# Altium schematic sheet BQ76952_AFE.SchDoc
size A4; Organization: TESLA Motors, INC; Address1: 3500 Deer Creek Road; Address2: Palo Alto, CA; Address4: U.S.A.; SheetNumber: 3; SheetTotal: 8
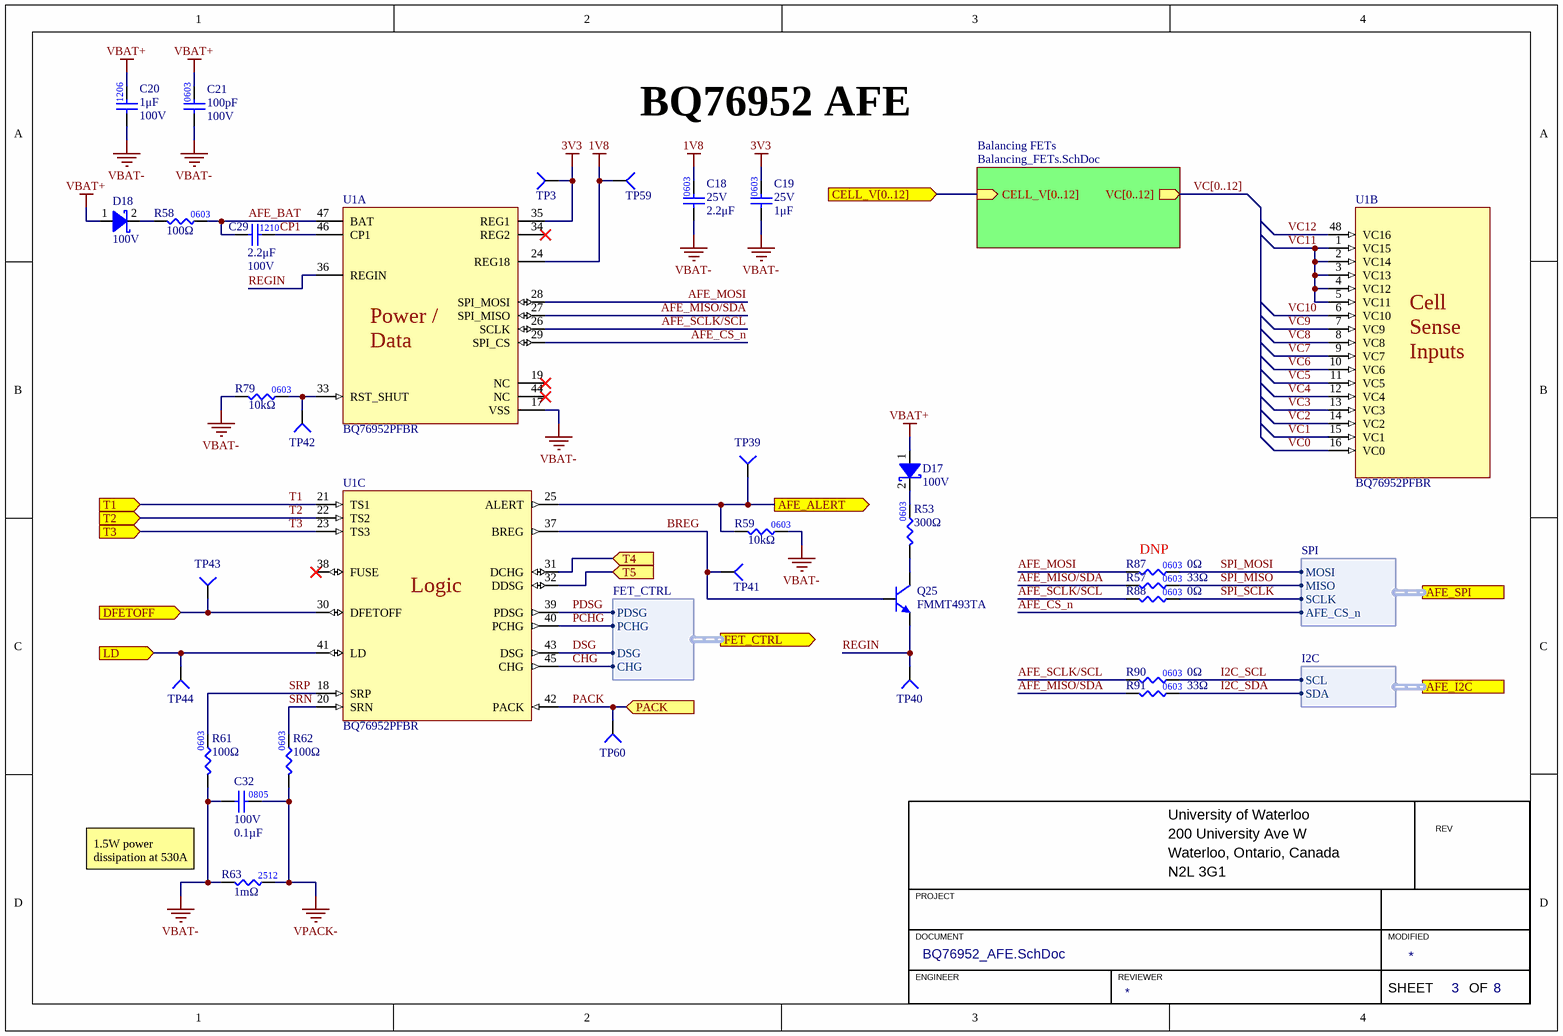
[diagram p0: BQ76952_AFE.SchDoc]

## Parts
C18  value 2.2μF  Voltage Rating: 25V  [CAP0603]  (hidden comment: CAP_2.2uF_25V_0603)
C19  value 1μF  Voltage Rating: 25V  [CAP0603]  (hidden comment: CAP_1uF_25V_0603)
C20  value 1μF  Voltage Rating: 100V  [CAP1206]  (hidden comment: CAP_1uF_100V_1206)
C21  value 100pF  Voltage Rating: 100V  [CAP2012]  (hidden comment: CAP_100pF_100V_0603)
C29  value 2.2μF  Voltage Rating: 100V  [CAP1210]  (hidden comment: CAP_2.2uF_100V_1210)
C32  value 0.1µF  Voltage Rating: 100V  [CAP0805]  (hidden comment: CAP_0.1uF_100V_0805)
D17  Vr (Max): 100V  [SOD-123_FLAT]  (hidden comment: DIO_SCHOTTKY_100V_1A)
D18  Vr (Max): 100V  [SOD-123_FLAT]  (hidden comment: DIO_SCHOTTKY_100V_1A)
Q25  Manufacturer Part Number 1: FMMT493TA  [SOT23-3]  (hidden comment: NPN_100V_1A)
R53  value 300Ω  [RES0603]  (hidden comment: RES_300Ω_0603_1%)
R57  value 33Ω  [RES0603]  (hidden comment: RES_33Ω_0603_1%)
R58  value 100Ω  [RES0603]  (hidden comment: RES_100Ω_0603_1%)
R59  value 10kΩ  [RES0603]  (hidden comment: RES_10kΩ_0603_1%)
R61  value 100Ω  [RES0603]  (hidden comment: RES_100Ω_0603_1%)
R62  value 100Ω  [RES0603]  (hidden comment: RES_100Ω_0603_1%)
R63  value 1mΩ  [RESC6532X75N]  (hidden comment: RES_1mΩ_2512_1%)
R79  value 10kΩ  [RES0603]  (hidden comment: RES_10kΩ_0603_1%)
R87  value 0Ω  [RES0603]  (hidden comment: RES_0Ω_0603)
R88  value 0Ω  [RES0603]  (hidden comment: RES_0Ω_0603)
R90  value 0Ω  [RES0603]  (hidden comment: RES_0Ω_0603)
R91  value 33Ω  [RES0603]  (hidden comment: RES_33Ω_0603_1%)
TP3  TESTPOINT_SMD_LOOP  [S1751-46R]  (value not drawn)
TP39  TESTPOINT_1MM_CIRCLE  [TESTPOINT_CIRCLE_1MM]  (value not drawn)  (no BOM)
TP40  TESTPOINT_1MM_CIRCLE  [TESTPOINT_CIRCLE_1MM]  (value not drawn)  (no BOM)
TP41  TESTPOINT_1MM_CIRCLE  [TESTPOINT_CIRCLE_1MM]  (value not drawn)  (no BOM)
TP42  TESTPOINT_1MM_CIRCLE  [TESTPOINT_CIRCLE_1MM]  (value not drawn)  (no BOM)
TP43  TESTPOINT_1MM_CIRCLE  [TESTPOINT_CIRCLE_1MM]  (value not drawn)  (no BOM)
TP44  TESTPOINT_1MM_CIRCLE  [TESTPOINT_CIRCLE_1MM]  (value not drawn)  (no BOM)
TP59  TESTPOINT_1MM_SQUARE  [TESTPOINT_SQUARE_1MM]  (value not drawn)  (no BOM)
TP60  TESTPOINT_1MM_CIRCLE  [TESTPOINT_CIRCLE_1MM]  (value not drawn)  (no BOM)
U1  BQ76952PFBR  [TI_48-TQFP]  (parts A,B,C of 3)

## Sub-sheets
Balancing FETs = Balancing_FETs.SchDoc: CELL_V[0..12] (in), VC[0..12] (out)

## Ports
AFE_ALERT (out), AFE_I2C (harness I2C), AFE_SPI (harness SPI), CELL_V[0..12] (in), DFETOFF (in), FET_CTRL (out, harness FET_CTRL), LD (in), PACK (in), T1 (in), T2 (in), T3 (in), T4 (in), T5 (in)

## Harnesses
SPI: MOSI, MISO, SCLK, AFE_CS_n
FET_CTRL: PDSG, PCHG, DSG, CHG
I2C: SCL, SDA

## Nets
1V8: C18.2 TP59.1(=value) U1.24(REG18)
3V3: C19.2 TP3.1(=value) U1.35(REG1)
VBAT+: C20.2 C21.2 D17.1(Anode) D18.1(Anode)
VBAT-: C18.1 C19.1 C20.1 C21.1 C32.1 R59.2 R61.1 R63.1 R79.1 U1.17(VSS)
VPACK-: C32.2 R62.1 R63.2
AFE_ALERT: R59.1 TP39.1(=value) U1.25(ALERT) ; port AFE_ALERT
AFE_BAT: C29.1 R58.2 U1.47(BAT)
AFE_CS_n: U1.29(SPI_CS) ; port AFE_SPI.AFE_CS_n
AFE_MISO/SDA: R57.1 R91.1 U1.27(SPI_MISO)
AFE_MOSI: R87.1 U1.28(SPI_MOSI)
AFE_SCLK/SCL: R88.1 R90.1 U1.26(SCLK)
BREG: Q25.1(B) TP41.1(=value) U1.37(BREG)
CHG: U1.45(CHG) ; port FET_CTRL.CHG
CP1: C29.2 U1.46(CP1)
DFETOFF: TP43.1(=value) U1.30(DFETOFF) ; port DFETOFF
DSG: U1.43(DSG) ; port FET_CTRL.DSG
I2C_SCL: R90.2 ; port AFE_I2C.SCL
I2C_SDA: R91.2 ; port AFE_I2C.SDA
LD: TP44.1(=value) U1.41(LD) ; port LD
PACK: TP60.1(=value) U1.42(PACK) ; port PACK
PCHG: U1.40(PCHG) ; port FET_CTRL.PCHG
PDSG: U1.39(PDSG) ; port FET_CTRL.PDSG
REGIN: Q25.2(E) TP40.1(=value) U1.36(REGIN)
SPI_MISO: R57.2 ; port AFE_SPI.MISO
SPI_MOSI: R87.2 ; port AFE_SPI.MOSI
SPI_SCLK: R88.2 ; port AFE_SPI.SCLK
SRN: R62.2 U1.20(SRN)
SRP: R61.2 U1.18(SRP)
T1: U1.21(TS1) ; port T1
T2: U1.22(TS2) ; port T2
T3: U1.23(TS3) ; port T3
T4: U1.31(DCHG) ; port T4
T5: U1.32(DDSG) ; port T5
VC0: U1.16(VC0)
VC1: U1.15(VC1)
VC2: U1.14(VC2)
VC3: U1.13(VC3)
VC4: U1.12(VC4)
VC5: U1.11(VC5)
VC6: U1.10(VC6)
VC7: U1.9(VC7)
VC8: U1.8(VC8)
VC9: U1.7(VC9)
VC10: U1.6(VC10)
VC11: U1.1(VC15) U1.2(VC14) U1.3(VC13) U1.4(VC12) U1.5(VC11)
VC12: U1.48(VC16)
NetD17_2: D17.2(Cathode) R53.2
NetD18_2: D18.2(Cathode) R58.1
NetQ25_3: Q25.3(C) R53.1
NetR79_2: R79.2 TP42.1(=value) U1.33(RST_SHUT)

Not connected (* = marked no-connect by the designer): U1 19(NC)* 34(REG2)* 38(FUSE)* 44(NC)*

## Buses and harness runs
bus port CELL_V[0..12] = sheet Balancing FETs/CELL_V[0..12]
bus VC[0..12] = sheet Balancing FETs/VC[0..12]

## Notes on the sheet
- BQ76952 AFE
- (near R87) DNP
- University of Waterloo
- 200 University Ave W
- REV
- 1.5W power dissipation at 530A
- PROJECT
- Waterloo, Ontario, Canada
- N2L 3G1
- DOCUMENT
- ENGINEER
- REVIEWER
- MODIFIED
- SHEET
- OF
- (in symbol BQ7695204PFBR, part A) Power / / Data
- (in symbol BQ7695204PFBR, part B) Cell / Sense / Inputs
- (in symbol BQ7695204PFBR, part C) Logic
- (in symbol CAP_2.2uF_25V_0603) 0603
- (in symbol CAP_2.2uF_100V_1210) 1210
- (in symbol RES_100Ω_0603_1%) 0603

## Library data of the parts
C18 = CAP_2.2uF_25V_0603: CAP CER 2.2UF 25V X5R 0603; Manufacturer Part Number 1: C1608X5R1E225K080AB; Manufacturer 1: TDK Corporation; Dielectric: 5; Supplier Part Number 1: 445-5964-1-ND; Supplier 1: Digi-Key
C19 = CAP_1uF_25V_0603: CAP CER 1UF 25V X5R 0603; Manufacturer 1: Samsung; Manufacturer Part Number 1: CL10A105KA8NNNC; Supplier 1: Digi-Key; Mounting Type: SMD; Package: 0603; Supplier Part Number 1: 1276-1102-1-ND; Dielectric: X5R
C20 = CAP_1uF_100V_1206: CAP CER 1UF 100V X7R 1206; Supplier 1: Digi-Key; Mounting Type: SMD; Package: 1206; Supplier Part Number 1: 490-16468-1-ND
C21 = CAP_100pF_100V_0603: CAP CER 100PF 100V X7R 0603; Manufacturer 1: YAGEO; Manufacturer Part Number 1: CC0603KRX7R0BB101; Package/Footprint: 0603; Mounting Type: SMD; Dielectric: X7R; Supplier 1: Digi-Key; Supplier Part Number 1: 311-4048-1-ND
C29 = CAP_2.2uF_100V_1210: CAP CER 2.2UF 100V X7R 1210; Manufacturer 1: Taiyo Yuden; Manufacturer Part Number 1: HMK325B7225KMHP; Dielectric: X7R; Supplier 1: Digi-Key; Supplier Part Number 1: 587-5396-1-ND
C32 = CAP_0.1uF_100V_0805: CAP CER 0.1UF 100V X7R 0805; Manufacturer 1: TDK Corporation; Manufacturer Part Number 1: C2012X7R2A104K125AA; Package: 0805; Supplier 1: Digi-Key; Supplier Part Number 1: 445-1418-1-ND
D17 D18 = DIO_SCHOTTKY_100V_1A: DIODE SCHOTTKY 100V 1A SOD-123F; Manufacturer 1: SMC Diode Solutions; Manufacturer Part Number 1: DSS110U; Supplier 1: Digi-Key; Supplier Part Number 1: 1655-DSS110UCT-ND; Mounting Type: SMD; Package/Footprint: SOD-123F
Q25 = NPN_100V_1A: TRANS NPN 100V 1A SOT23-3; Manufacturer 1: Diodes Incorporated; Package: SOT-23-3; Supplier Part Number 1: FMMT493CT-ND; Supplier 1: Digi-Key
R53 = RES_300Ω_0603_1%: RES 200 OHM 1% 1/10W 0603; Manufacturer 1: YAGEO; Manufacturer Part Number 1: RL0603FR-070R3L; Supplier 1: Digi-Key; Supplier Part Number 1: 13-RL0603FR-070R3LCT-ND; Package: 0603; Tolerance: 1%
R57 R91 = RES_33Ω_0603_1%: RES 33 OHM 1% 1/10W 0603; Manufacturer 1: Vishay; Manufacturer Part Number 1: CRCW060333R0FKEA; Supplier 1: Digi-Key; Mounting Type: SMD; Supplier Part Number 1: 541-33.0HCT-ND; Package: 0603
R58 R61 R62 = RES_100Ω_0603_1%: RES 100 OHM 1% 1/10W 0603; Manufacturer 1: Yageo; Manufacturer Part Number 1: RC0603FR-07100RL; Supplier Part Number 1: 311-100HRCT-ND; Supplier 1: Digi-Key
R59 R79 = RES_10kΩ_0603_1%: RES 10K OHM 1% 1/8W 0603; Manufacturer 1: Stackpole Electronics Inc; Manufacturer Part Number 1: RNCP0603FTD10K0; Supplier Part Number 1: RNCP0603FTD10K0CT-ND; Supplier 1: Digi-Key; Mounting Type: SMD; Package: 0603
R63 = RES_1mΩ_2512_1%: RES 1 mOHM 1% 3W 2512; Manufacturer 1: Riedon; Manufacturer Part Number 1: CSRL3-0R001F8; Supplier 1: Digi-Key; Supplier Part Number 1: 696-1834-1-ND; Mounting Type: SMD; Package: 2512
R87 R88 R90 = RES_0Ω_0603: RES 0 OHM JUMPER 1/10W 0603; Manufacturer 1: Yageo; Manufacturer Part Number 1: RC0603JR-070RL; Supplier Part Number 1: 311-0.0GRCT-ND; Supplier 1: Digi-Key; Mounting Type: SMD; Package: 0603
TP3 = TESTPOINT_SMD_LOOP: TESTPOINT SMD LOOP; Manufacturer 1: Harwin; Supplier 1: Digi-Key; Manufacturer Part Number 1: S1751-46R; Mounting Type: SMD; Package/Footprint: SMD; Supplier Part Number 1: 952-1478-1-ND
TP39-TP44 TP60 = TESTPOINT_1MM_CIRCLE: TESTPOINT 1MM CIRCLE
TP59 = TESTPOINT_1MM_SQUARE: TESTPOINT 1MM SQUARE
U1 = BQ7695204PFBR: IC BAT LIFEPO4/LI-ION 3-16C TQFP; Manufacturer 1: Texas Instruments; Package/Footprint: 48-TQFP; Manufacturer Part Number 1: BQ76952PFBR; Supplier 1: Digi-Key; Supplier Part Number 1: 296-BQ76952PFBRCT-ND